# EAGLE design LoRa-GPS (EAGLE 7.7.0)
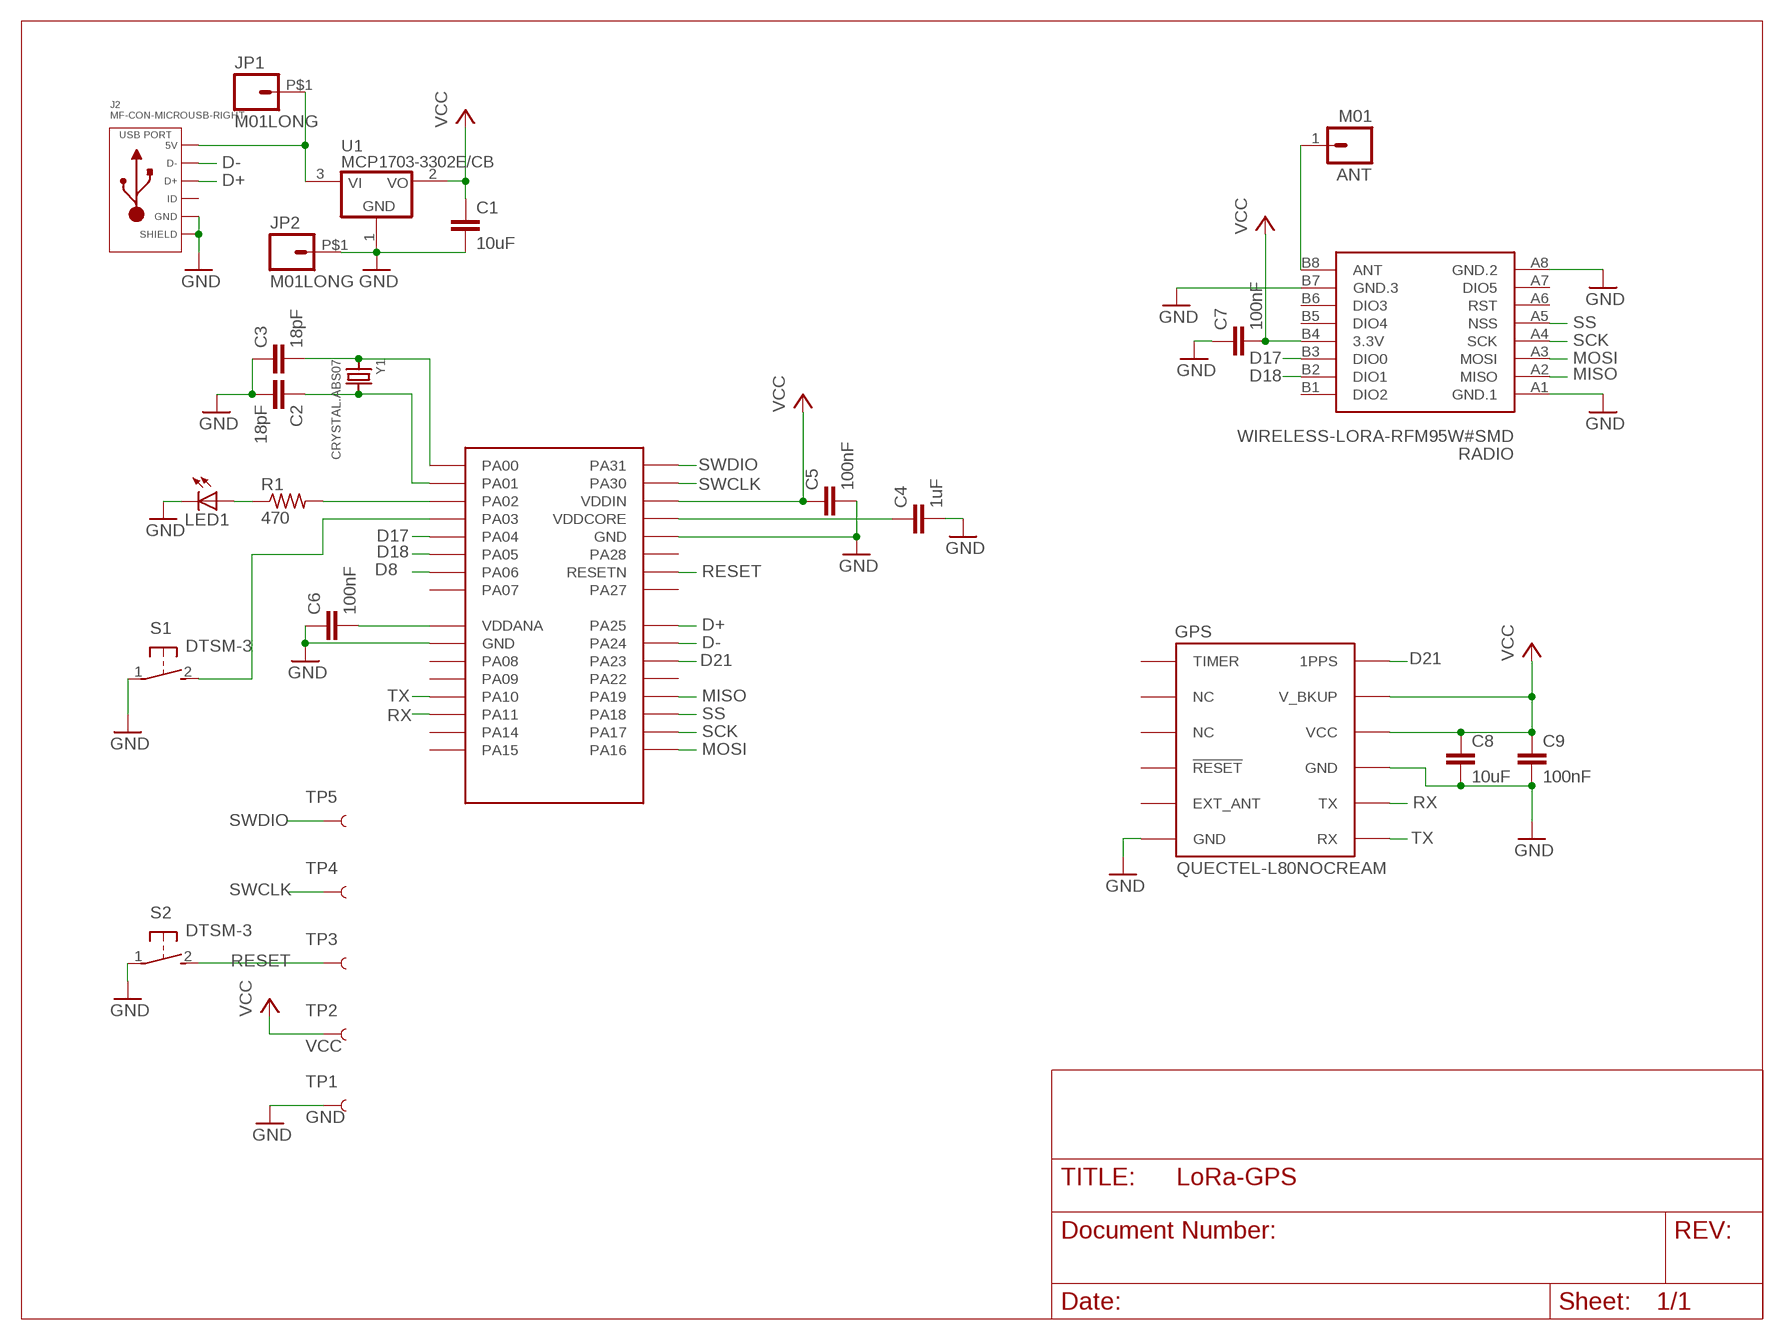
[diagram p0: schematic, sheet 1]

## Parts
ANT  M01  [1X01]
C1  10uF  CAPC0603-THINCREAM  [C0603-THINCREAM]
C2  18pF  CAPC0603-THINCREAM  [C0603-THINCREAM]
C3  18pF  CAPC0603-THINCREAM  [C0603-THINCREAM]
C4  1uF  CAPC0603-THINCREAM  [C0603-THINCREAM]
C5  100nF  CAPC0603-THINCREAM  [C0603-THINCREAM]
C6  100nF  CAPC0603-THINCREAM  [C0603-THINCREAM]
C7  100nF  CAPC0603-THINCREAM  [C0603-THINCREAM]
C8  10uF  CAPC0603-THINCREAM  [C0603-THINCREAM]
C9  100nF  CAPC0603-THINCREAM  [C0603-THINCREAM]
GPS  QUECTEL-L80NOCREAM  [QUECTEL-L80-NOCREAM]
J2  MF-CON-MICROUSB-RIGHT  USB_MICRO_RIGHT  [MICROUSB-RIGHT]
JP1  M01LONG  [1X01_LONG]
JP2  M01LONG  [1X01_LONG]
LED1  LEDCHIPLED_0805_THINCREAM  [CHIPLED_0805-THINCREAM]
R1  470  R-USR0603-THINCREAM  [R0603-THINCREAM]
RADIO  WIRELESS-LORA-RFM95W#SMD  [WIRELESS-LORA-RFM95W#SMD]
S1  DTSM-3  [DTSM-3]
S2  DTSM-3  [DTSM-3]
SAMD21  ATSAMD21E18A-AU  [32-TQFP]
TP1  GND  TEST-POINTTP_15TH_THRU  [TP_15TH]
TP2  VCC  TEST-POINT3X5  [PAD.03X.05]
TP3  TEST-POINT3X5  [PAD.03X.05]
TP4  TEST-POINT3X5  [PAD.03X.05]
TP5  TEST-POINT3X5  [PAD.03X.05]
U1  MCP1703-3302E/CB  [SOT23A_MICROCHIP_CB]
Y1  CRYSTAL.ABS07  [ABS07]

## Nets
ANT: ANT.1 RADIO.B8(ANT)
D8: SAMD21.7(PA06)
D17: RADIO.B3(DIO0) SAMD21.5(PA04)
D18: RADIO.B2(DIO1) SAMD21.6(PA05)
D21: GPS.6(1PPS) SAMD21.22(PA23)
D+: J2.3(D+) SAMD21.24(PA25)
D-: J2.2(D-) SAMD21.23(PA24)
GND: C1.2 C2.2 C3.1 C4.2 C5.2 C6.1 C7.1 C8.2 C9.2 GPS.3(GND) GPS.12(GND) J2.5(GND) J2.S1(SLD) J2.S2(SLD) J2.S3(SLD) J2.S4(SLD) JP2.P$1 LED1.C RADIO.A1(GND.1) RADIO.A8(GND.2) RADIO.B7(GND.3) S1.1 S2.1 SAMD21.10(GND) SAMD21.28(GND) TP1.P$1 U1.1(GND)
MISO: RADIO.A2(MISO) SAMD21.20(PA19)
MOSI: RADIO.A3(MOSI) SAMD21.17(PA16)
N$1: C6.2 SAMD21.9(VDDANA)
N$2: C2.1 SAMD21.2(PA01) Y1.2
N$3: C3.2 SAMD21.1(PA00) Y1.1
N$4: LED1.A R1.1
N$5: C4.1 SAMD21.29(VDDCORE)
N$6: R1.2 SAMD21.3(PA02)
N$9: S1.2 SAMD21.4(PA03)
RESET: S2.2 SAMD21.26(RESETN) TP3.P$1
RX: GPS.2(TX) SAMD21.14(PA11)
SCK: RADIO.A4(SCK) SAMD21.18(PA17)
SS: RADIO.A5(NSS) SAMD21.19(PA18)
SWCLK: SAMD21.31(PA30) TP4.P$1
SWDIO: SAMD21.32(PA31) TP5.P$1
TX: GPS.1(RX) SAMD21.13(PA10)
VCC: C1.1 C5.1 C7.2 C8.1 C9.1 GPS.4(VCC) GPS.5(V_BKUP) RADIO.B4(3.3V) SAMD21.30(VDDIN) TP2.P$1 U1.2(VO)
VIN: J2.1(5V) JP1.P$1 U1.3(VI)
Unconnected: GPS.7(TIMER) GPS.8(NC) GPS.9(NC) GPS.10(!RESET) GPS.11(EXT_ANT) J2.4(ID) RADIO.A6(RST) RADIO.A7(DIO5) RADIO.B1(DIO2) RADIO.B5(DIO4) RADIO.B6(DIO3) SAMD21.8(PA07) SAMD21.11(PA08) SAMD21.12(PA09) SAMD21.15(PA14) SAMD21.16(PA15) SAMD21.21(PA22) SAMD21.25(PA27) SAMD21.27(PA28)

## Library data of the parts
ANT JP1 JP2 = nootropicdesign:M01: 2-pin header
C1-C9 = nootropicdesign:CAP: Unpolarized capacitor
GPS = quectel:QUECTEL-L80: Description: L80 is an ultra slim GPS POT (Patch on Top) module with an embedded 15.0 × 15.0 × 4.0mm patch antenna. This space-saving design makes L80 become the perpect module for the miniature devices. Adopted by LCC package and integrated with patch antenna, L80 has exceptional performance both in acquisition and tracking. Combining advanced AGPS called EASY™ (Embedded Assist System) and proven AlwaysLocate™ technology.
J2 = nootropicdesign:USB: Library: MF_Connectors Description: 5 Pin USB Connectors. SLD is the shield connection. Usually tied to ground through a small ferrite bead.; HOUSEPART: YES; MPN: MF-CON-MICROUSB-RIGHT; POPULATE: 1; URL: https://factory.macrofab.com/part/MF-CON-MICROUSB-RIGHT
LED1 = nootropicdesign:LED: LED OSRAM: - CHIPLED LG R971, LG N971, LY N971, LG Q971, LY Q971, LO R971, LY R971 LH N974, LH R974 LS Q976, LO Q976, LY Q976 LO Q996 - Hyper CHIPLED LW Q18S LB Q993, LB Q99A, LB R99A - SideLED LS A670, LO A670, LY A670, LG A670, LP A670 LB A673, LV A673, LT A673, LW A673 LH A674 LY A675 LS A676, LA A676, LO A676, LY A676, LW A676 LS A679, LY A679, LG A679 - Hyper Micro SIDELED® LS Y876, LA Y876, LO Y876, LY Y876 LT Y87S - SmartLED LW L88C, LW L88S LB L89C, LB L89S, LG L890 LS L89K, LO L89K, LY L89K LS L896, LA L896, LO L896, LY L896 - TOPLED LS T670, LO T670, LY T670, LG T670, LP T670 LSG T670, LSP T670, LSY T670, LOP T670, LYG T670 LG T671, LOG T671, LSG T671 LB T673, LV T673, LT T673, LW T673 LH T674 LS T676, LA T676, LO T676, LY T676, LB T676, LH T676, LSB T676, LW T676 LB T67C, LV T67C, LT T67C, LS T67K, LO T67K, LY T67K, LW E67C LS E67B, LA E67B, LO E67B, LY E67B, LB E67C, LV E67C, LT E67C LW T67C LS T679, LY T679, LG T679 LS T770, LO T770, LY T770, LG T770, LP T770 LB T773, LV T773, LT T773, LW T773 LH T774 LS E675, LA E675, LY E675, LS T675 LS T776, LA T776, LO T776, LY T776, LB T776 LHGB T686 LT T68C, LB T68C - Hyper Mini TOPLED® LB M676 - Mini TOPLED Santana® LG M470 LS M47K, LO M47K, LY M47K Source: http://www.osram.convergy.de/
R1 = nootropicdesign:R-US: Resistor
RADIO = diy-modules:WIRELESS-LORA-RFM95W: 868/915 MHz LoRa Radio Transceiver Module based on SX1276 chip Click here to find device on ebay.com <http://www.ebay.com/sch/RFM95W+transceiver>
S1 S2 = switch-tact:DTSM-3
SAMD21 = atmel-samd21:ATSAMD21E18A-AU
TP1-TP5 = SparkFun-Passives:TEST-POINT: Bare copper test points for troubleshooting or ICT
U1 = MCP1703:MCP1703*02E/CB: MCP1703[A] Series of Voltage Regulators – SOT23A (Microchip CB) (1.2 … 5.0)V, LDO, 16 V Input, 100/150/200/250 mA, Low Quiescent Current Source: http://ww1.microchip.com/downloads/en/DeviceDoc/22049f.pdf http://ww1.microchip.com/downloads/en/DeviceDoc/25122A.pdf Packages: SOT23, Microchip package identifier "CB" (dimensions and recommended land patterns acc. to Microchip) Technologies: MCP1703[A]T-xx02E/CB T : Tape and Reel xx: Output Voltage * 1000 mV; 12|15|18|25|28|30|33|40|50 0 : Extra Feature Code (fixed) 2 : Output volt. Tol.: ±2% (standard) E : Temperature range (−40…+125)°C CB: Package: SOT23A Author: Dipl.-Ing. FH Rainer Bayer HHN Hochschule Heilbronn, rainer.bayer@hs-heilbronn.de Ingenieurbüro ing-rb, mail@ing-rb.de
Y1 = abracon:CRYSTAL

## Board
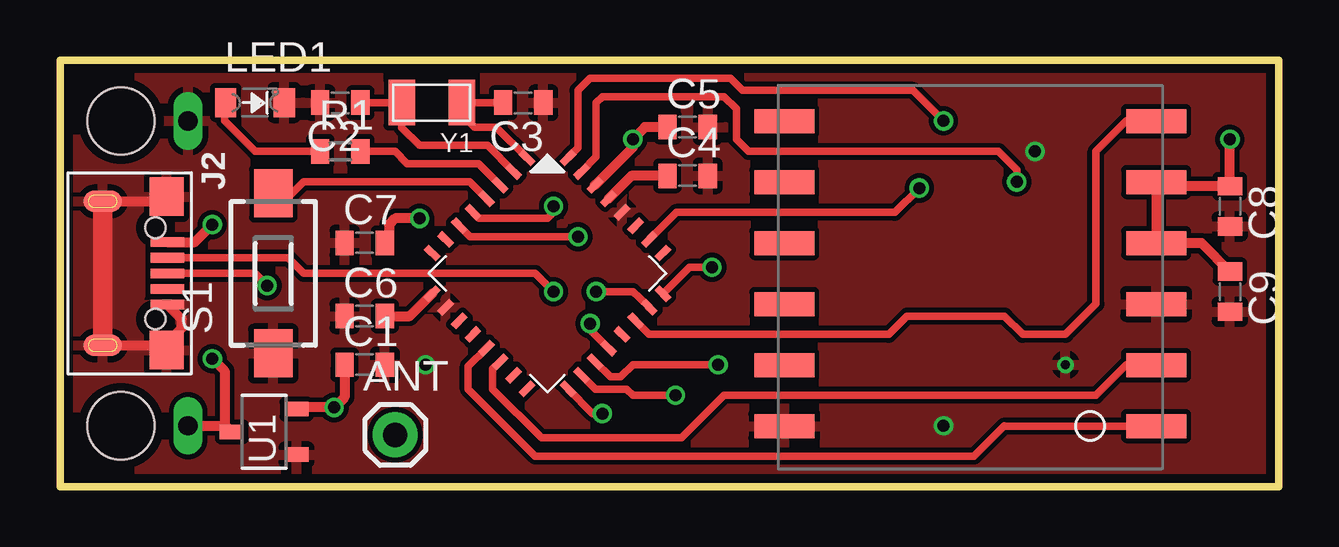
[diagram p1: board, top side]
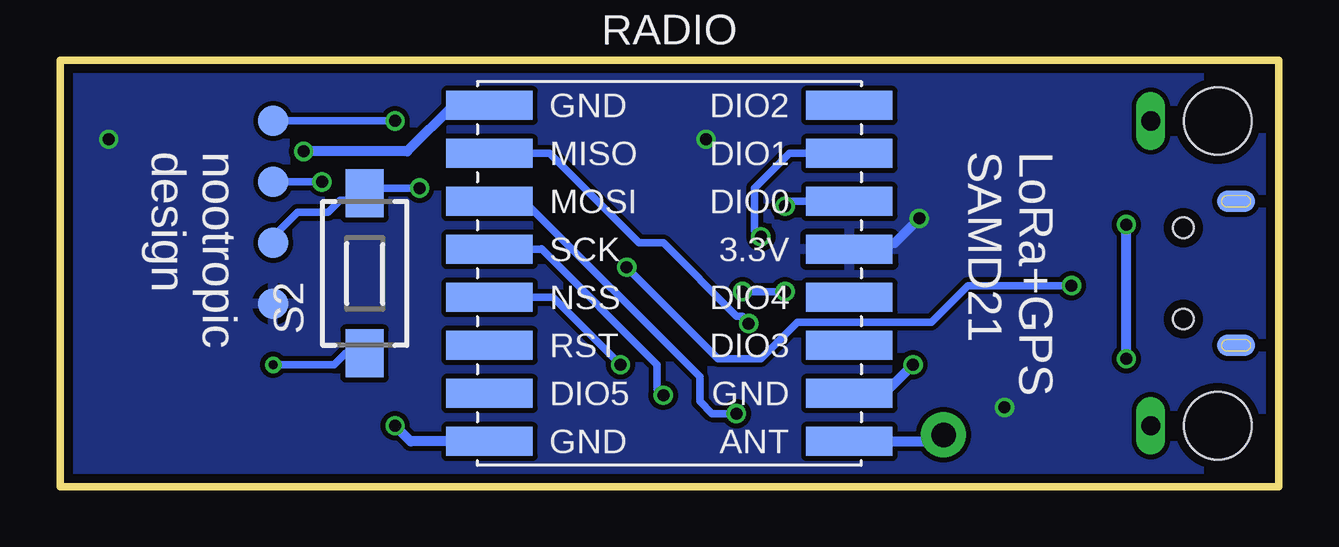
[diagram p2: board, bottom side, seen from below]

Size 50.8 x 17.78 mm. Coordinates in mm from the lower left corner, seen from the top.
Outline: 0,0 50.8,0 50.8,17.78 0,17.78 0,0
Copper layers (1*16): Top 0.035559375mm / dielectric 1.6mm / Bottom 0.035559375mm
Design rules "oshpark-2layer-forItead *": minimum track width 6mil, minimum drill 10mil, track to track 8mil, track to pad 8mil, pad to pad 8mil, via to via 8mil, smd to smd 8mil, copper to edge 15mil, drill to drill 6mil, minimum pad ring 6mil, minimum via ring 6mil, stop-mask expansion 4mil, vias tented up to drill 0mil, thermal gap 10mil
Holes 2.8 mm at 2.54,2.54 2.54,15.24
tKeepout: area 37.9,8.6 to 38.1,8.8; area 37.6,8.3 to 38.4,9.1; area 37.3,8 to 38.7,9.4; area 37,7.7 to 39,9.7; area 36.7,7.4 to 39.3,10

### Footprints (pad centres in the part's own frame; a part is rotated, then mirrored left to right if it is on the bottom)
1X01 = drill 1.016 pad 1.88: 1 0,0
C0603-THINCREAM = smd 0.762 x 1.016: 1 -0.838,0; 2 0.838,0
QUECTEL-L80-NOCREAM = smd 2.5 x 1: 1 17.75,3.8; 2 17.75,6.34; 3 17.75,8.88; 4 17.75,11.42; 5 17.75,13.96; 6 17.75,16.5; 7 2.25,16.5; 8 2.25,13.96; 9 2.25,11.42; 10 2.25,8.88; 11 2.25,6.34; 12 2.25,3.8
MICROUSB-RIGHT = smd 0.4 x 1.4: 1 -1.3,2.7; 2 -0.65,2.7; 3 0,2.7; 4 0.65,2.7; 5 1.3,2.7 | smd 0.9 x 1.6: S1 -3,0; S2 3,0 | smd 1.6 x 1.4: S3 -3.2,2.67; S4 3.2,2.67 | smd 0.9 x 1.6 bottom: S7 -3,0; S8 3,0 | hole 0.85: -1.9,2.2; 1.9,2.2
1X01_LONG = drill 0.8 long: P$1 0,0
CHIPLED_0805-THINCREAM = smd 1.206 x 0.889: A 0,-1.219; C 0,1.219
R0603-THINCREAM = smd 0.762 x 1.016: 1 -0.838,0; 2 0.838,0
WIRELESS-LORA-RFM95W#SMD = smd 3.6 x 1.2: A1 -7.5,7; A2 -7.5,5; A3 -7.5,3; A4 -7.5,1; A5 -7.5,-1; A6 -7.5,-3; A7 -7.5,-5; A8 -7.5,-7; B1 7.5,7; B2 7.5,5; B3 7.5,3; B4 7.5,1; B5 7.5,-1; B6 7.5,-3; B7 7.5,-5; B8 7.5,-7
DTSM-3 = smd 2 x 1.6: 1 -3.335,0; 2 3.335,0
32-TQFP = smd 0.7 x 0.3: 1 -4,2.8; 2 -4,2; 3 -4,1.2; 4 -4,0.4; 5 -4,-0.4; 6 -4,-1.2; 7 -4,-2; 8 -4,-2.8; 17 4,-2.8; 18 4,-2; 19 4,-1.2; 20 4,-0.4; 21 4,0.4; 22 4,1.2; 23 4,2; 24 4,2.8 | smd 0.3 x 0.7: 9 -2.8,-4; 10 -2,-4; 11 -1.2,-4; 12 -0.4,-4; 13 0.4,-4; 14 1.2,-4; 15 2,-4; 16 2.8,-4; 25 2.8,4; 26 2,4; 27 1.2,4; 28 0.4,4; 29 -0.4,4; 30 -1.2,4; 31 -2,4; 32 -2.8,4
TP_15TH = drill 0.381 pad 0.61: P$1 0,0
PAD.03X.05 = smd 1.27 x 1.27: P$1 0,0
SOT23A_MICROCHIP_CB = smd 0.6 x 1: 1 -0.95,-1.35; 2 0.95,-1.35; 3 0,1.35
ABS07 = smd 1.1 x 1.9: 1 -1.25,0; 2 1.25,0

### Placement (x,y rotation side)
ANT  13.97,2.16 0 top
C1  12.7,5.08 0 top
C2  11.68,16 180 top
C3  19.3,16 180 top
C4  26.16,12.95 0 top
C5  26.16,14.99 0 top
C6  12.7,7.11 0 top
C7  12.7,10.16 0 top
C8  48.77,11.68 270 top
C9  48.77,8.13 270 top
GPS  27.94,-1.27 0 top
J2  1.78,8.89 270 top
JP1  5.33,2.54 90 top
JP2  5.33,15.24 90 top
LED1  8.13,16 270 top
R1  11.68,13.97 0 top
RADIO  25.4,8.89 0 bottom
S1  8.89,8.89 90 top
S2  38.1,8.89 90 bottom
SAMD21  20.32,8.89 315 top
TP1  41.91,5.08 0 top
TP2  41.91,7.62 0 bottom
TP3  41.91,10.16 0 bottom
TP4  41.91,12.7 0 bottom
TP5  41.91,15.24 0 bottom
U1  8.51,2.29 90 top
Y1  15.49,16 180 top

### Tracks (layer width: path | path; a pad name or v marks a point on that pad's centre or on a via)
ANT
  Bottom 0.406: RADIO.B8 14.24,1.89 ANT.1
D17  (via drill 0.5)
  Top 0.305: v20.57,11.68 20.57,11.43 20.32,11.18 17.47,11.18 SAMD21.5
  Bottom 0.305: RADIO.B3 20.37,11.89 v20.57,11.68
D18  (via drill 0.5)
  Top 0.305: v21.59,10.41 17.1,10.41 SAMD21.6
  Bottom 0.305: RADIO.B2 20.4,13.89 21.84,12.45 21.84,10.67 v21.59,10.41
D21
  Top 0.305: SAMD21.22 24.56,6.35 34.54,6.35 35.31,7.11 39.37,7.11 40.13,6.35 41.91,6.35 43.18,7.62 43.18,13.97 44.45,15.24 GPS.6
D+  (via drill 0.5)
  Top 0.305: J2.3 8.13,8.89 v8.64,8.38 | v27.18,9.14 26.23,9.14 SAMD21.24
  Bottom 0.305: v8.64,8.38 12.95,8.38 14.48,6.86 20.07,6.86 21.59,5.33 23.37,5.33 v27.18,9.14
D-  (via drill 0.5)
  Top 0.305: 24.53,7.48 SAMD21.23 24.16,7.87 23.88,8.13 v22.35,8.13 | J2.2 9.51,9.54 10.16,8.89 19.81,8.89 v20.57,8.13
  Bottom 0.305: v20.57,8.13 v22.35,8.13
GND  (via drill 0.5)
  Top 0.406: J2.S1 4.25,11.89 J2.S3 | J2.S2 4.25,5.89 | 4.25,5.89 J2.S4 | 4.25,5.89 4.37,5.89 5.08,6.6 5.08,6.99 J2.5
  Top 0.813: J2.S1 J2.S2
  Bottom 0.305: S2.1 38.9,5.55 39.37,5.08 TP1.P$1
  Bottom 0.406: RADIO.B7 16.43,3.89 v15.24,5.08 | RADIO.A8 36.18,1.89 v36.83,2.54 | RADIO.A1 34.4,15.89 36.32,13.97 v40.64,13.97
  pour Top: 0,0 0,17.78 50.8,17.78 50.8,0
MISO  (via drill 0.5)
  Top 0.305: v22.1,6.8 22.1,6.55 SAMD21.20
  Bottom 0.305: RADIO.A2 30.4,13.89 26.67,10.16 25.65,10.16 22.61,7.11 22.35,7.11 22.1,6.86 v22.1,6.8
MOSI  (via drill 0.5)
  Top 0.305: v22.61,3.05 22.2,3.05 SAMD21.17
  Bottom 0.305: RADIO.A3 31.45,11.89 24.13,4.57 24.13,3.56 23.62,3.05 v22.61,3.05
N$1
  Top 0.406: C6.2 14.58,7.11 SAMD21.9
N$2
  Top 0.305: C2.1 Y1.2 14.24,14.97 14.99,14.22 17.81,14.22 SAMD21.2
N$3
  Top 0.305: SAMD21.1 18.18,14.99 17.27,14.99 17.02,15.24 17.02,16 16.51,16.51 16.51,15.24 16.74,15.47 Y1.1 C3.2
  Top 0.406: 17.02,16.51 17.02,16.28 Y1.1
N$4
  Top 0.305: R1.1 8.13,13.97 6.86,15.24 6.86,15.95 LED1.A 7.11,15.95
N$5
  Top 0.406: C4.1 23.82,12.95 SAMD21.29
N$6
  Top 0.305: R1.2 13.97,13.97 14.48,13.46 17.45,13.46 SAMD21.3
N$9
  Top 0.305: 9.05,11.59 10.16,12.7 17.08,12.7 SAMD21.4
  Top 0.406: S1.2 9.05,11.59
RESET  (via drill 0.5)
  Top 0.305: SAMD21.26 25.69,11.43 34.8,11.43 v35.81,12.45
  Bottom 0.305: S2.2 38.58,12.22 | v35.81,12.45 37.88,12.45 S2.2 | TP3.P$1 41.91,10.41 40.89,11.43 39.62,11.43 39.12,11.94 38.39,11.94 S2.2
RX
  Top 0.305: GPS.2 44.45,5.08 43.18,3.81 27.69,3.81 25.91,2.03 20.07,2.03 18.03,4.06 18.03,4.91 SAMD21.14
  Top 0.406: GPS.2
SCK  (via drill 0.5)
  Top 0.305: v25.65,3.81 23.88,3.81 23.62,4.06 22.32,4.06 SAMD21.18
  Bottom 0.305: RADIO.A4 30.75,9.89 30.73,9.91 25.91,5.08 25.91,4.06 v25.65,3.81
SS  (via drill 0.5)
  Top 0.305: v27.43,5.08 23.88,5.08 23.37,4.57 22.94,4.57 SAMD21.19
  Bottom 0.305: RADIO.A5 30.24,7.89 v27.43,5.08
SWCLK  (via drill 0.5)
  Top 0.305: SAMD21.31 22.35,13.75 22.35,16 22.61,16.26 27.69,16.26 28.19,15.75 28.19,14.48 28.7,13.97 39.12,13.97 39.88,13.21 v39.88,12.7
  Bottom 0.305: TP4.P$1 v39.88,12.7
SWDIO  (via drill 0.5)
  Top 0.305: SAMD21.32 21.59,14.12 21.59,16.51 22.1,17.02 27.94,17.02 28.45,16.51 35.56,16.51 v36.83,15.24
  Bottom 0.305: TP5.P$1 v36.83,15.24
TX
  Top 0.305: GPS.1 39.38,2.53 39.37,2.54 38.1,1.27 19.81,1.27 17.02,4.06 17.02,5.02 SAMD21.13
VCC  (via drill 0.5)
  Top 0.406: GPS.5 GPS.4 | 45.93,9.91 GPS.4 | v14.99,11.18 13.97,11.18 13.72,10.92 13.72,10.34 C7.2 | 11.68,4.9 C1.1 11.86,3.73 v11.43,3.3 9.93,3.3 U1.2 | GPS.4 47.57,10.16 C9.1 | GPS.5 45.69,12.73 | GPS.5 | v48.77,14.48 C8.1 45.86,12.52 GPS.5 | C5.1 24.38,14.99 v23.88,14.48 23.88,14.14 SAMD21.30
  Bottom 0.406: RADIO.B4 17.9,10.04 17.78,10.16 16,10.16 v14.99,11.18
  pour Bottom: 0,17.78 50.8,17.78 50.8,0 0,0
VIN  (via drill 0.5)
  Top 0.406: J2.1 5.62,10.19 v6.35,10.92 | v6.35,5.33 6.86,4.83 6.86,2.59 U1.3 6.91,2.54 JP1.P$1
  Bottom 0.406: v6.35,5.33 v6.35,10.92

### Text on the board
bPlace: LoRa+GPS / SAMD21 | nootropic / design